# EAGLE design motor (EAGLE 6.5.0)
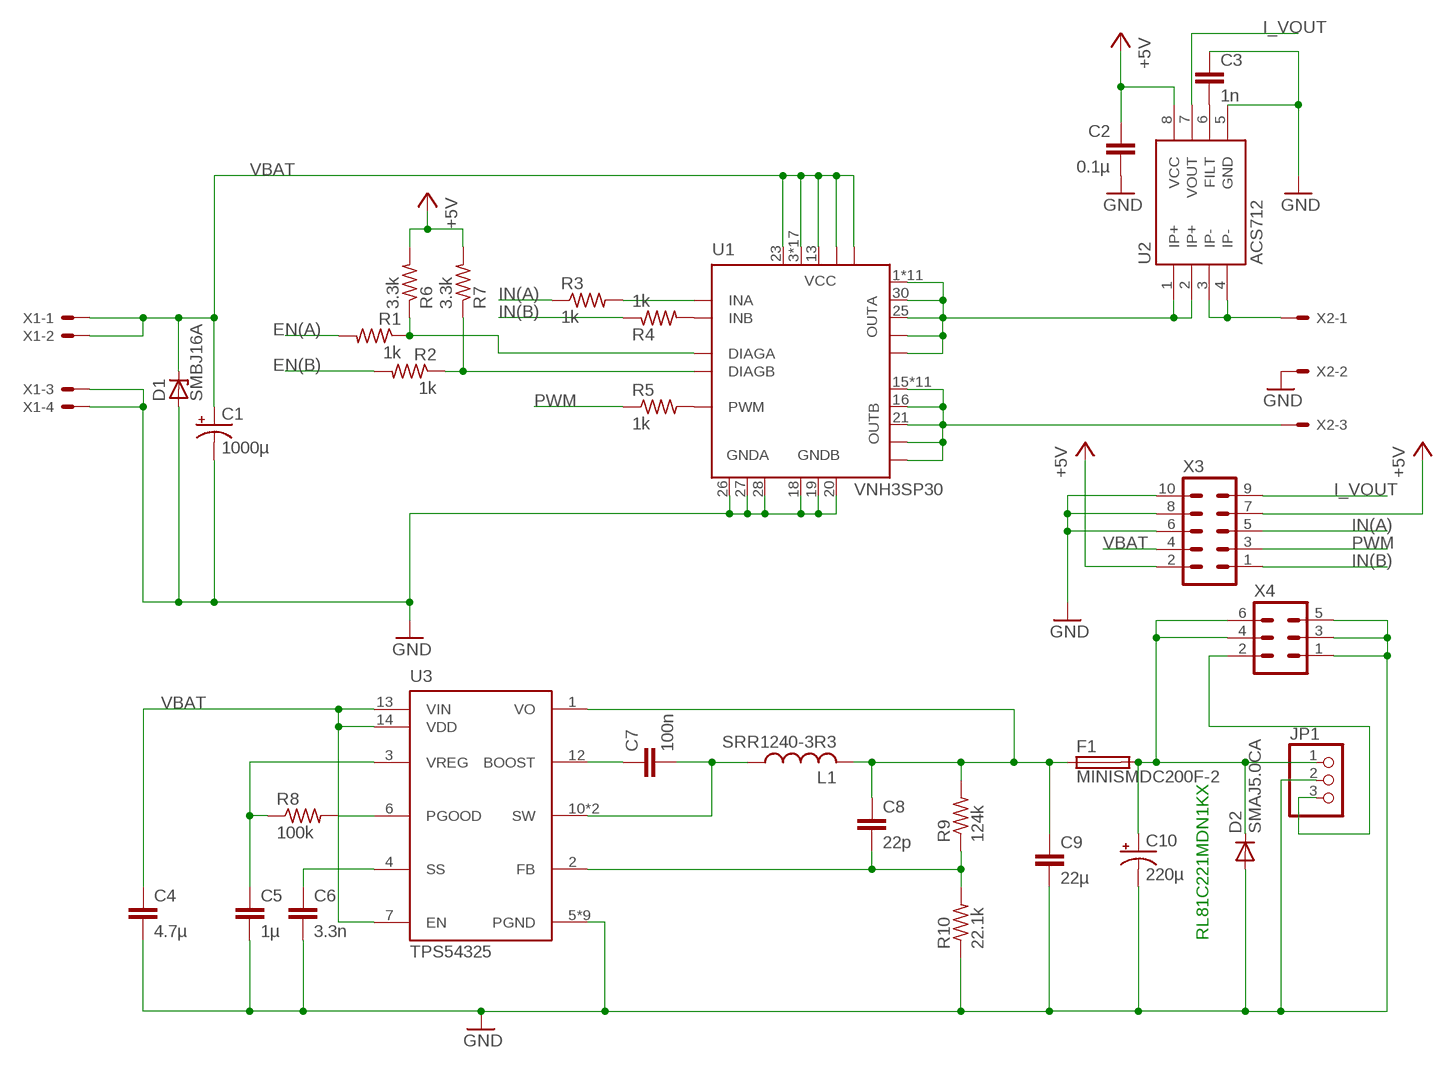
[diagram p0: schematic, sheet 1]

## Parts
C1  1000µ  CPOL-USE5-13  [E5-13]
C2  0.1µ  C-EUC0805  [C0805]
C3  1n  C-EUC0805  [C0805]
C4  4.7µ  C-EUC1206  [C1206]
C5  1µ  C-EUC0805  [C0805]
C6  3.3n  C-EUC0805  [C0805]
C7  100n  C-EUC0805  [C0805]
C8  22p  C-EUC0805  [C0805]
C9  22µ  C-EUC3225  [C3225]
C10  220µ  CPOL-USE3.5-8  [E3,5-8]
D1  SMBJ16A  ZENER-DIODESMB  [SMB]
D2  SMAJ5.0CA  DIODE-DO-214AC  [DO-214AC]
F1  MINISMDC200F-2  FUSEMINISMDC200F  [MINISMDC200F]
JP1  PINHD-1X3  [1X03]
L1  SRR1240-3R3  L-USHCM1103  [HCM1103]
R1  1k  R-US_R0805  [R0805]
R2  1k  R-US_R0805  [R0805]
R3  1k  R-US_R0805  [R0805]
R4  1k  R-US_R0805  [R0805]
R5  1k  R-US_R0805  [R0805]
R6  3.3k  R-US_R0805  [R0805]
R7  3.3k  R-US_R0805  [R0805]
R8  100k  R-US_R0805  [R0805]
R9  124k  R-US_R0805  [R0805]
R10  22.1k  R-US_R0805  [R0805]
U1  VNH3SP30  [MULTIPOWERSO-30]
U2  ACS712  [SO08]
U3  TPS54325  [HTSSOP14PWP]
X1  KK-156-4  [KK-156-4]
X2  KK-156-3  [KK-156-3]
X3  ML10  [ML10]
X4  ML6  [ML6]

## Nets
+5V: C2.1 R6.2 R7.2 U2.8(VCC) X3.2 X3.7
+5V/S: C8.1 C9.1 F1.1 L1.P$2 R9.2 U3.1(VO)
EN(A): R1.2
EN(B): R2.2
GND: C1.- C2.2 C3.1 C4.2 C5.2 C6.2 C9.2 C10.- D1.A D2.A JP1.2 R10.1 U1.18(GNDB) U1.19(GNDB) U1.20(GNDB) U1.26(GNDA) U1.27(GNDA) U1.28(GNDA) U2.5(GND) U3.5(PGND) U3.8(PGND) U3.9(PGND) U3.EXP1(PGND) U3.EXP(PGND) U3.P$1(PGND) U3.P$2(PGND) U3.P$3(PGND) U3.P$4(PGND) X1.3 X1.4 X2.2 X3.6 X3.8 X3.10 X4.1 X4.3 X4.5
I_VOUT: U2.7(VOUT) X3.9
IN(A): R3.1 X3.5
IN(B): R4.1 X3.1
N$1 [power]: U1.15(OUTB) U1.16(OUTB) U1.21(OUTB) U1.OUTB U1.OUTB1(OUTB) U1.OUTB2(OUTB) U1.OUTB3(OUTB) U1.OUTB4(OUTB) U1.OUTB5(OUTB) U1.OUTB6(OUTB) U1.OUTB7(OUTB) U1.OUTB8(OUTB) U1.OUTB9(OUTB) U1.OUTB10(OUTB) U1.OUTB@1(OUTB) X2.3
N$2 [power]: U1.1(OUTA) U1.25(OUTA) U1.30(OUTA) U1.OUTA U1.OUTA1(OUTA) U1.OUTA2(OUTA) U1.OUTA3(OUTA) U1.OUTA4(OUTA) U1.OUTA5(OUTA) U1.OUTA6(OUTA) U1.OUTA7(OUTA) U1.OUTA8(OUTA) U1.OUTA9(OUTA) U1.OUTA10(OUTA) U1.OUTA@1(OUTA) U2.1(IP+) U2.2(IP+)
N$3: R3.2 U1.5(INA)
N$4: R4.2 U1.11(INB)
N$6: R8.2 U3.6(PGOOD)
N$7: R1.1 R6.1 U1.6(DIAGA)
N$8: R2.1 R7.1 U1.10(DIAGB)
N$9: U2.3(IP-) U2.4(IP-) X2.1
N$10: C5.1 R8.1 U3.3(VREG)
N$11: C3.2 U2.6(FILT)
N$12: C6.1 U3.4(SS)
N$14: C7.1 U3.12(BOOST)
N$15: C7.2 L1.P$1 U3.10(SW) U3.11(SW)
N$16: C8.2 R9.1 R10.2 U3.2(FB)
N$17: C10.+ D2.C F1.2 JP1.1 X4.4 X4.6
N$18: R5.2 U1.8(PWM)
PWM: R5.1 X3.3
S_CTL: JP1.3 X4.2
VBAT: C1.+ C4.1 D1.C U1.3(VCC) U1.13(VCC) U1.23(VCC) U1.VCC U1.VCC1(VCC) U1.VCC2(VCC) U1.VCC3(VCC) U1.VCC4(VCC) U1.VCC5(VCC) U1.VCC6(VCC) U1.VCC7(VCC) U1.VCC8(VCC) U1.VCC9(VCC) U1.VCC10(VCC) U1.VCC11(VCC) U1.VCC12(VCC) U1.VCC13(VCC) U1.VCC14(VCC) U1.VCC15(VCC) U1.VCC16(VCC) U1.VCC@1(VCC) U3.7(EN) U3.13(VIN) U3.14(VDD) X1.1 X1.2 X3.4

## Notes on the sheet
- RL81C221MDN1KX

## Library data of the parts
C1 C10 = rcl:CPOL-US: POLARIZED CAPACITOR, American symbol
C2-C9 = rcl:C-EU: CAPACITOR, European symbol
D1 = diode:ZENER-DIODE: Z-Diode
D2 = diode:DIODE-: DIODE
F1 = miniSMDC200F:FUSE
JP1 = pinhead:PINHD-1X3: PIN HEADER
L1 = inductors:L-US: INDUCTOR, American symbol
R1-R10 = rcl:R-US_: RESISTOR, American symbol
U1 = VNH3SP30:VNH3SP30: FULLY INTEGRATED H-BRIDGE MOTOR DRIVER Source: http://pdf1.alldatasheet.com/datasheet-pdf/view/84563/STMICROELECTRONICS/VNH3SP30.html; MPN: VNH3SP30-E; OC_FARNELL: 1739420; OC_NEWARK: 33R1486
U2 = SparkFun-AnalogIC:ACS712: Hall-effect-based isolated linear current sensor
U3 = TPS54325:TPS54325
X1 = con-molex:KK-156-4: KK 156 HEADER Source: http://www.molex.com/pdm_docs/sd/026604100_sd.pdf; OC_FARNELL: unknown; OC_NEWARK: unknown
X2 = con-molex:KK-156-3: KK 156 HEADER Source: http://www.molex.com/pdm_docs/sd/026604100_sd.pdf; OC_FARNELL: unknown; OC_NEWARK: unknown
X3 = con-ml:ML10: HARTING; OC_FARNELL: unknown; OC_NEWARK: unknown
X4 = con-harting-ml:ML6: HARTING; OC_FARNELL: unknown; OC_NEWARK: unknown

## Net classes
1 power: clearance 0.813 mm

## Board
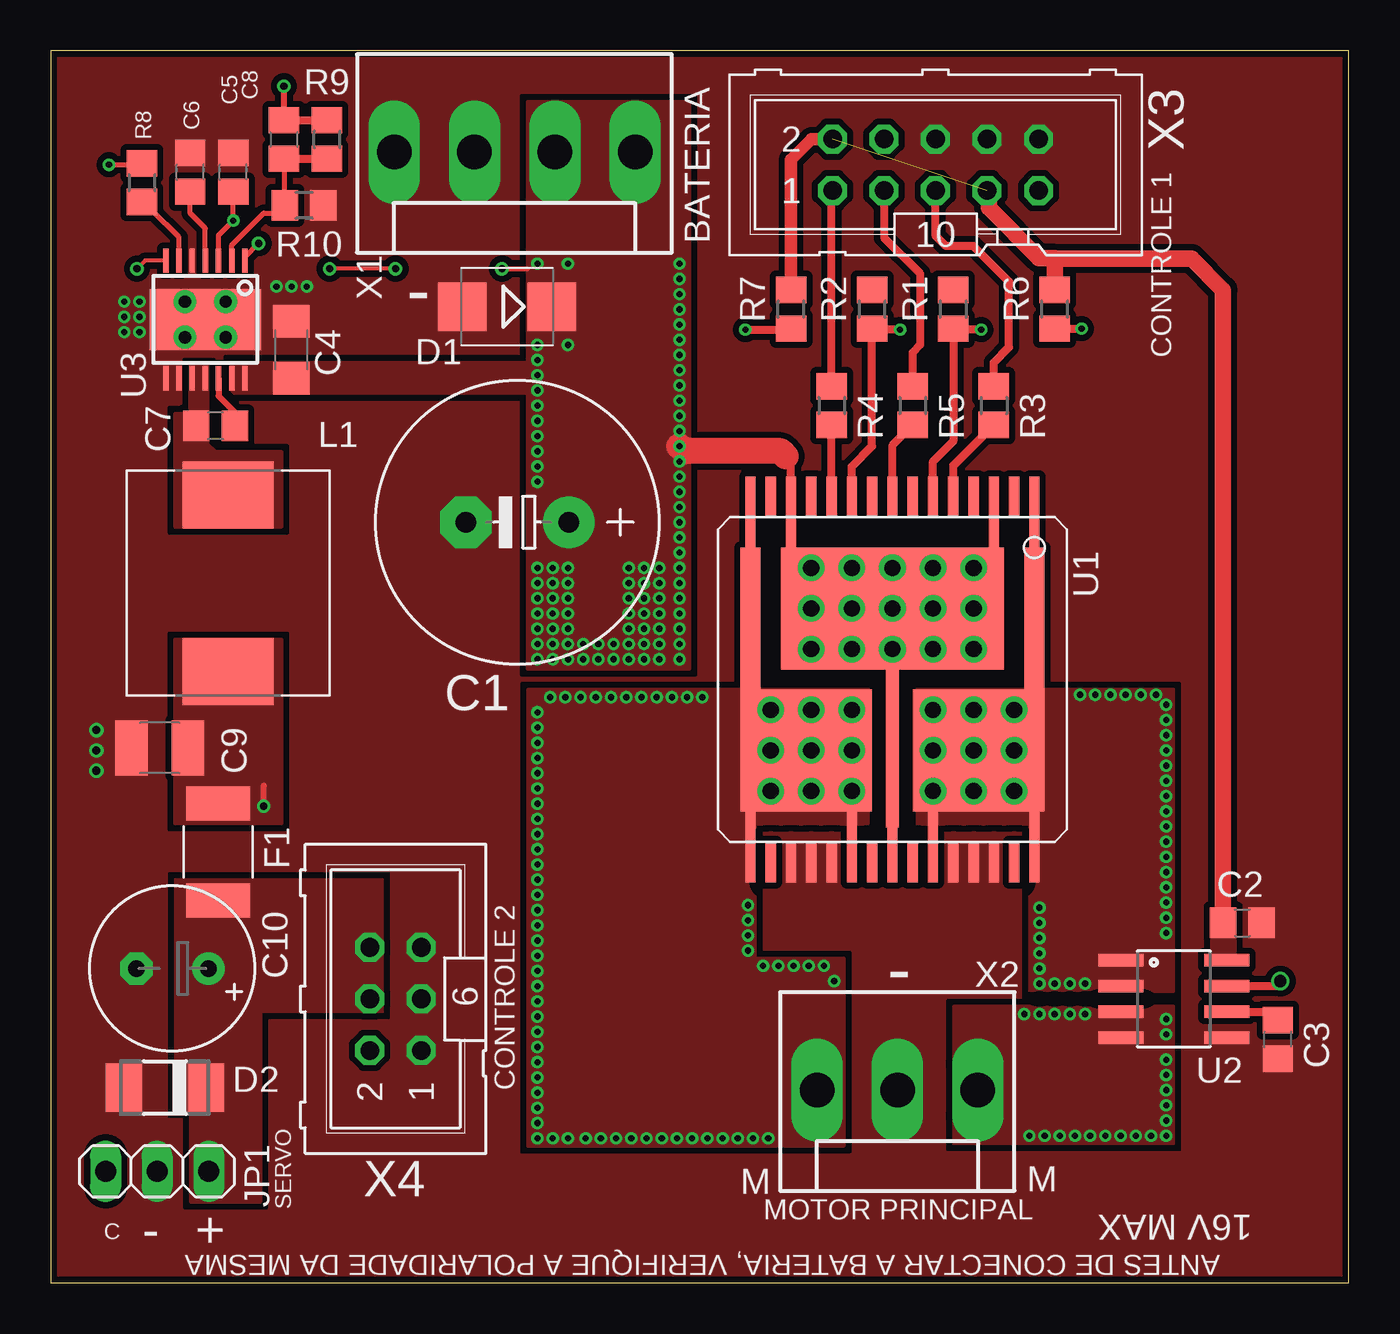
[diagram p1: board, top side]
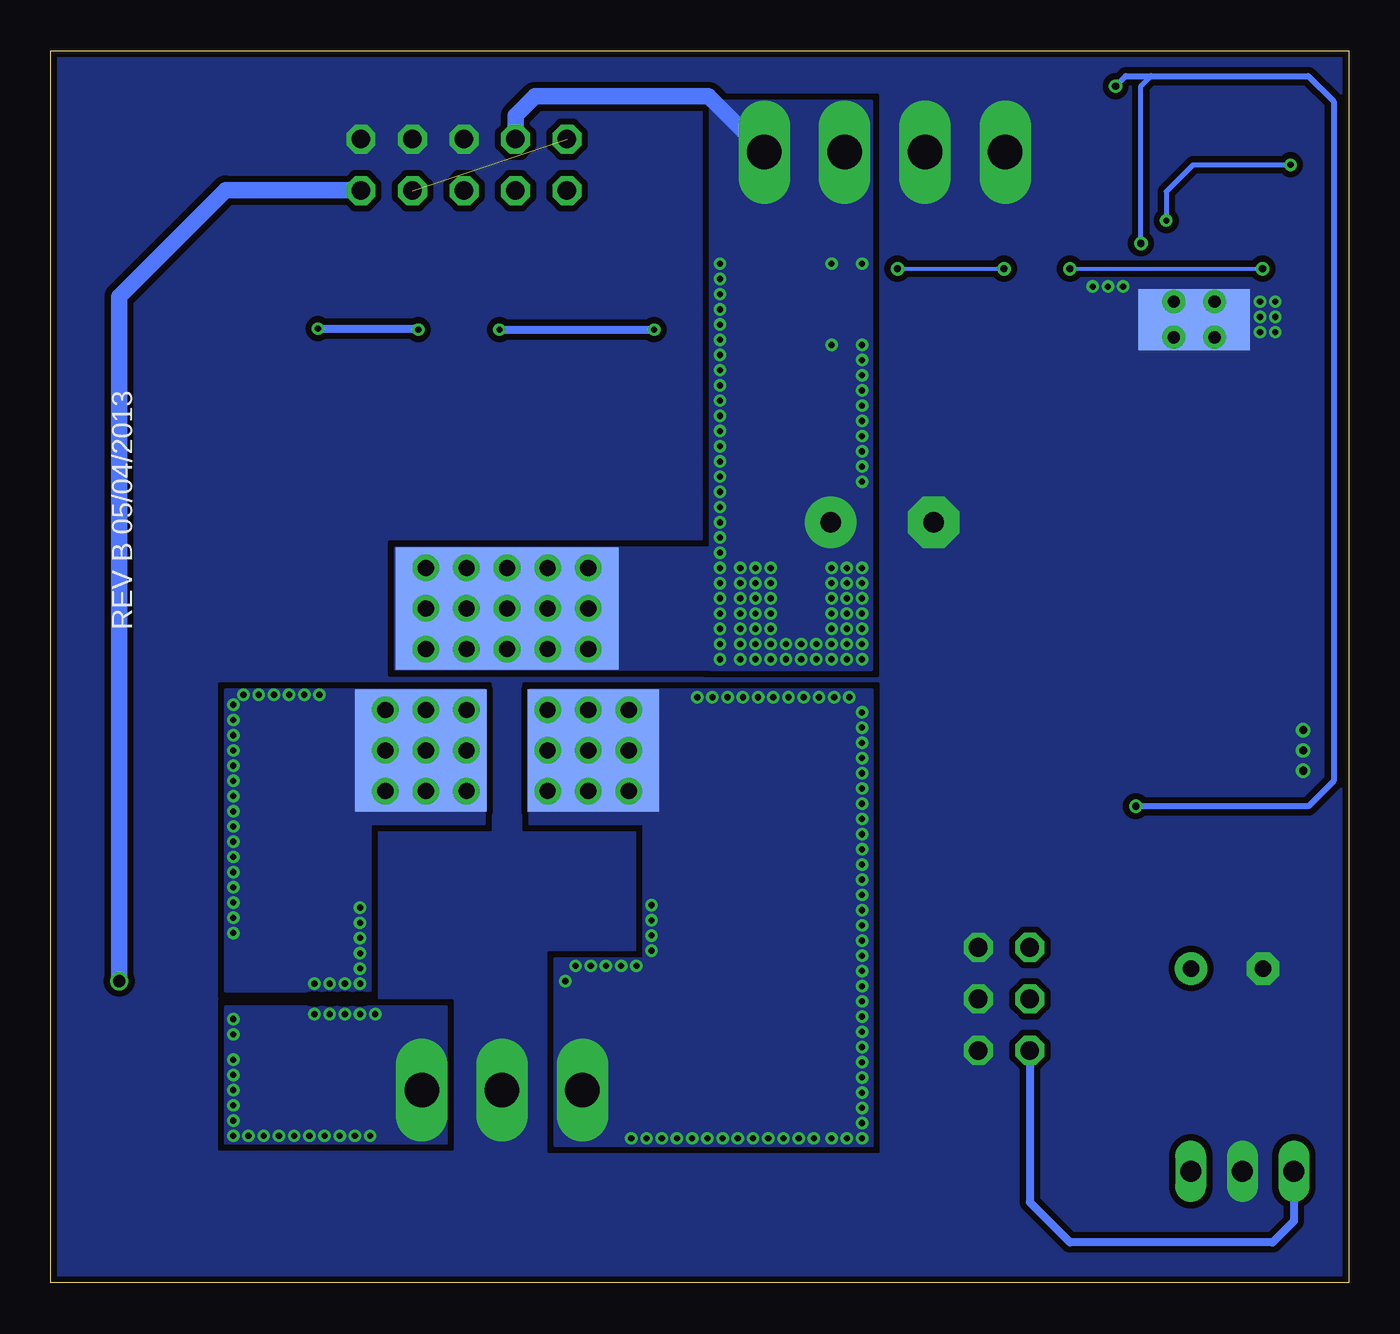
[diagram p2: board, bottom side, seen from below]

Size 64 x 60.75 mm. Coordinates in mm from the lower left corner, seen from the top.
Outline: 64,0 64,60.75 0,60.75 0,0 64,0
Copper layers (1*16): Top 0.035mm / dielectric 1.5mm / Bottom 0.035mm
Design rules "Fusion_eagle_rule_v1.1": minimum track width 6mil, minimum drill 12mil, track to track 6mil, track to pad 6mil, pad to pad 6mil, via to via 6mil, smd to smd 0mil, copper to edge 10mil, drill to drill 10mil, minimum pad ring 10mil, minimum via ring 6mil, stop-mask expansion 2mil, vias tented up to drill 100mil, thermal gap 10mil

### Footprints (pad centres in the part's own frame; a part is rotated, then mirrored left to right if it is on the bottom)
E5-13 = drill 1.016 pad 2.54: + -2.54,0 | drill 1.016 pad 2.54 octagon: - 2.54,0
C0805 = smd 1.3 x 1.5: 1 -0.95,0; 2 0.95,0
C1206 = smd 1.6 x 1.8: 1 -1.4,0; 2 1.4,0
C3225 = smd 1.6 x 2.7: 1 -1.4,0; 2 1.4,0
E3,5-8 = drill 0.813 pad 1.6: + -1.778,0 | drill 0.813 pad 1.6 octagon: - 1.778,0
SMB = smd 2.4 x 2.4: A 2.2,0; C -2.2,0
DO-214AC = smd 1.8 x 2.4: A 2.025,0; C -2.025,0
MINISMDC200F = smd 1.68 x 3.15: 1 -2.39,0; 2 2.39,0
1X03 = drill 1.016 long: 1 -2.54,0; 2 0,0; 3 2.54,0
HCM1103 = smd 3.3 x 4.5: P$1 -4.35,0; P$2 4.35,0
R0805 = smd 1.3 x 1.5: 1 -0.95,0; 2 0.95,0
MULTIPOWERSO-30 = smd 0.508 x 12: 1 -7,-4; 15 7,-4; 16 7,4; 30 -7,4 | smd 0.508 x 2: 2 -6,-9; 4 -4,-9; 5 -3,-9; 6 -2,-9; 7 -1,-9; 8 0,-9; 9 1,-9; 10 2,-9; 11 3,-9; 12 4,-9; 14 6,-9; 17 6,9; 18 5,9; 19 4,9; 20 3,9; 22 1,9; 24 -1,9; 26 -3,9; 27 -4,9; 28 -5,9; 29 -6,9 | smd 0.508 x 4: 3 -5,-8; 13 5,-8; 21 2,8; 23 0,8; 25 -2,8 | smd 6.5 x 6 bottom: OUTA -4.25,3.5; OUTB 4.25,3.5 | smd 6.5 x 6: OUTA1 -4.25,3.5; OUTB1 4.25,3.5 | drill 0.8: OUTA2 -6,5.5; OUTA3 -4,5.5; OUTA4 -2,5.5; OUTA5 -6,3.5; OUTA6 -4,3.5; OUTA7 -2,3.5; OUTA8 -2,1.5; OUTA9 -4,1.5; OUTA10 -6,1.5; OUTB2 2,5.5; OUTB3 4,5.5; OUTB4 6,5.5; OUTB5 6,3.5; OUTB6 4,3.5; OUTB7 2,3.5; OUTB8 2,1.5; OUTB9 4,1.5; OUTB10 6,1.5; VCC2 -4,-1.5; VCC3 -2,-1.5; VCC4 0,-1.5; VCC5 2,-1.5; VCC6 4,-1.5; VCC7 4,-3.5; VCC8 2,-3.5; VCC9 0,-3.5; VCC10 -2,-3.5; VCC11 -4,-3.5; VCC12 -4,-5.5; VCC13 -2,-5.5; VCC14 0,-5.5; VCC15 2,-5.5; VCC16 4,-5.5 | smd 1 x 7.5: OUTA@1 -7,-2.755; OUTB@1 7,-2.755 | smd 11 x 6 bottom: VCC 0,-3.5 | smd 11 x 6: VCC1 0,-3.5 | smd 0.65 x 8.3: VCC@1 0,3.145
SO08 = smd 0.61 x 2.21: 1 -1.905,-2.616; 2 -0.635,-2.616; 3 0.635,-2.616; 4 1.905,-2.616; 5 1.905,2.616; 6 0.635,2.616; 7 -0.635,2.616; 8 -1.905,2.616
HTSSOP14PWP = smd 0.27 x 1.2: 1 -1.95,-2.9; 2 -1.3,-2.9; 3 -0.65,-2.9; 4 0,-2.9; 5 0.65,-2.9; 6 1.3,-2.9; 7 1.95,-2.9; 8 1.95,2.9; 9 1.3,2.9; 10 0.65,2.9; 11 0,2.9; 12 -0.65,2.9; 13 -1.3,2.9; 14 -1.95,2.9 | smd 5.5 x 3 bottom: EXP 0,0 | smd 5.5 x 3: EXP1 0,0 | drill 0.61: P$1 -1,0.875; P$2 -1,-0.875; P$3 1,-0.875; P$4 1,0.875
KK-156-4 = drill 1.7 pad 2.184 long: 1 -5.94,0; 2 -1.98,0; 3 1.98,0; 4 5.94,0
KK-156-3 = drill 1.7 pad 2.184 long: 1 -3.96,0; 2 0,0; 3 3.96,0
ML10 = drill 0.914 octagon: 1 -5.08,-1.27; 2 -5.08,1.27; 3 -2.54,-1.27; 4 -2.54,1.27; 5 0,-1.27; 6 0,1.27; 7 2.54,-1.27; 8 2.54,1.27; 9 5.08,-1.27; 10 5.08,1.27
ML6 = drill 0.914 octagon: 1 -2.54,-1.27; 2 -2.54,1.27; 3 0,-1.27; 4 0,1.27; 5 2.54,-1.27; 6 2.54,1.27

### Placement (x,y rotation side)
C1  23,37.5 180 top
C2  58.75,17.75 0 top
C3  60.5,12 90 top
C4  11.88,46 90 top
C5  9,54.75 90 top
C6  6.88,54.75 90 top
C7  8.12,42.25 180 top
C8  11.5,56.38 270 top
C9  5.38,26.38 180 top
C10  6,15.5 180 top
D1  22.5,48.12 180 top
D2  5.62,9.62 180 top
F1  8.25,21.25 270 top
JP1  5.25,5.5 180 top
L1  8.75,34.5 270 top
R1  44.5,48 90 top
R2  40.5,48 90 top
R3  46.5,43.25 270 top
R4  38.5,43.25 270 top
R5  42.5,43.25 270 top
R6  49.5,48 90 top
R7  36.5,48 90 top
R8  4.5,54.25 270 top
R9  13.62,56.38 90 top
R10  12.5,53.12 180 top
U1  41.5,29.75 180 top
U2  55.38,14 270 top
U3  7.62,47.5 180 top
X1  22.88,55.75 180 top
X2  41.75,9.5 180 top
X3  43.62,55.12 0 top
X4  17,14 90 top

### Tracks (layer width: path | path; a pad name or v marks a point on that pad's centre or on a via)
+5V  (1 unrouted)
  Top 0.61: R7.2 36.5,55.38 37.5,56.38 38.52,56.38 X3.2
  Top 0.813: R6.2 49.5,50.52 | 49.5,50.52 49.52,50.5 56.25,50.5 57.8,48.95 C2.1 | 49.5,50.52 48.73,50.52 46.25,53 46.25,53.77 X3.7
  pour Top (isolate 0.254, no thermals): 57.25,18.38 58.38,18.38 58.38,15.75 57.25,15.75
+5V/S  (via drill 0.36)
  Top 0.254: U3.1 9.57,50.58 v10.25,51.25
  Top 0.305: C8.1 v11.5,59 | v10.5,23.5 10.5,24.5
  Top 0.406: C8.1 R9.2
  Bottom 0.254: v10.25,51.25 10.25,59 9.75,59.5
  Bottom 0.305: v11.5,59 11,59.5 9.75,59.5 2,59.5 0.75,58.25 0.75,24.75 2,23.5 v10.5,23.5
  pour Top (isolate 0.406, no thermals): 6.12,31.75 11.38,31.75 11.38,22.62 6.12,22.62
GND  (via drill 0.3, 0.4)
  other vias: 3.62,48.38 3.62,47.62 3.62,46.88 4.38,47.62 4.38,48.38 4.38,46.88 2.25,27.25 2.25,26.25 2.25,25.25 11.12,49.12 11.88,49.12 12.62,49.12
  pour Top (isolate 0.305, rank 6, no thermals): 0,0 64,0 64,60.75 0,60.75
  pour Bottom (isolate 0.305, rank 6, no thermals): 0,0 64,0 64,60.75 0,60.75
I_VOUT  (via drill 0.6)
  Top 0.406: U2.7 60.38,14.63 v60.62,14.88
  Bottom 0.813: v60.62,14.88 60.62,48.62 55.38,53.88 48.73,53.88 X3.9
IN(A)
  Top 0.406: R3.1 46.5,45.38 47.25,46.12 47.25,49.38 45.5,51.12 44.12,51.12 43.62,51.62 X3.5
IN(B)
  Top 0.406: R4.1 38.5,53.81 X3.1
N$1  (via drill 0.3)
  other vias: 34.38,18.62 34.38,17.88 34.38,17.12 34.38,16.38 35.12,15.62 35.88,15.62 36.62,15.62 37.38,15.62 38.12,15.62 32.12,28.88 31.38,28.88 30.62,28.88 29.88,28.88 29.12,28.88 28.38,28.88 27.62,28.88 26.88,28.88 26.12,28.88 24,28.12 24,27.38 24,26.62 24,25.88 24,25.12 24,24.38 24,23.62 24,22.88 24,22.12 24,21.38 24,20.62 24,19.88 24,19.12 24,18.38 24,17.62 24,16.88 24,16.12 24,15.38 24,14.62 24,13.88 24,13.12 24,12.38 24,11.62 24,10.88 24,8.62 24,7.88 26.38,7.12 27.12,7.12 27.88,7.12 28.62,7.12 29.38,7.12 30.12,7.12 30.88,7.12 31.62,7.12 32.38,7.12 33.12,7.12 33.88,7.12 34.62,7.12 35.38,7.12 24,9.38 24,10.12 38.62,14.88 25.38,28.88 25.5,7.12 24.62,28.88 24.75,7.12 24,7.12
  pour Bottom (isolate 0.813, no thermals): 40.38,29.25 23.5,29.25 23.5,6.75 39.12,6.75 39.12,16 34.75,16 34.75,22.62 40.38,22.62
  pour Top (isolate 0.813, no thermals): 40.38,29.25 23.5,29.25 23.5,6.75 39.12,6.75 39.12,16 34.75,16 34.75,22.62 40.38,22.62
N$2  (via drill 0.3)
  other vias: 50.75,29 51.5,29 52.25,29 53,29 53.75,29 54.5,29 55,28.5 55,27.75 55,27 55,26.25 55,25.5 55,24.75 55,24 55,23.25 55,22.5 55,21.75 55,21 55,20.25 55,19.5 55,18.75 55,18 55,17.25 48.75,18.5 48.75,17.75 48.75,17 48.75,16.25 48.75,15.5 48.75,14.75 49.5,14.75 50.25,14.75 51,14.75
  pour Bottom (isolate 0.813, no thermals): 42.62,29.25 42.62,22.62 48.25,22.62 48.25,14.38 55.38,14.38 55.38,29.25
  pour Top (isolate 0.813, no thermals): 42.62,29.25 42.62,22.62 48.25,22.62 48.25,14.38 55.38,14.38 55.38,29.25
N$3
  Top 0.406: U1.5 44.5,40.3 R3.2
N$4
  Top 0.406: U1.11 R4.2
N$6
  Top 0.254: U3.6 6.33,51.55 5,52.88 4.92,52.88 R8.2
N$7  (via drill 0.3)
  Top 0.406: R6.1 v50.83,47.05 | v45.88,47 44.55,47 R1.1 44.5,41.5 43.5,40.5 U1.6
  Bottom 0.406: v50.83,47.05 46.05,47.05 v45.88,47
N$8  (via drill 0.3)
  Top 0.406: v34.25,47 36.45,47 R7.1 | v41.88,47 40.55,47 R2.1 40.5,41.25 39.5,40.25 U1.10
  Bottom 0.406: v41.88,47 v34.25,47
N$9  (via drill 0.3)
  other vias: 48,13.25 48.75,13.25 49.5,13.25 50.25,13.25 51,13.25 55,11 55,12.25 55,13 55,10.25 55,9.5 55,8.75 55,7.25 54.25,7.25 53.5,7.25 52.75,7.25 52,7.25 51.25,7.25 50.5,7.25 49.75,7.25 49,7.25 48.25,7.25 55,8
  pour Top (isolate 0.813, no thermals): 44.5,6.88 55.38,6.88 55.38,13.62 44.5,13.62
  pour Bottom (isolate 0.813, no thermals): 44.5,6.88 55.38,6.88 55.38,13.62 44.5,13.62
N$10  (via drill 0.3)
  Top 0.254: U3.3 8.28,51.65 v9,52.38 C5.1 | v2.88,55.12 4.42,55.12 R8.1
  Bottom 0.254: v2.88,55.12 7.67,55.12 C5.1 v9,52.38
N$11
  Top 0.406: U2.6 60.09,13.37 C3.2
N$12
  Top 0.254: U3.4 7.62,52 6.88,52.75 C6.1
N$14
  Top 0.305: U3.12 8.28,43.73 9.25,42.75 9.25,42.42 C7.1
N$15
  pour Top (no thermals): 6.88,45.25 7.75,45.25 7.75,41.62 6.88,41.62
  pour Top (isolate 0.254, no thermals): 7.75,42.88 7.75,41.38 8.12,41 11.38,41 11.38,37.25 6.12,37.25 6.12,42.88
N$16
  Top 0.254: U3.2 8.93,51.17 10.5,52.75 11.18,52.75 R10.2 11.5,53.17 C8.2
  Top 0.406: C8.2 R9.1
N$17
  pour Top (isolate 0.254, no thermals): 6.12,19.88 6.12,8.5 6.88,8.5 6.88,4 10.38,4 10.38,19.88
  pour Top (isolate 0.254, no thermals): 9.38,13.38 16.38,13.38 16.38,19.88 9.38,19.88
N$18
  Top 0.406: U1.8 41.5,41.3 R5.2
PWM
  Top 0.406: R5.1 42.5,45.88 42.88,46.25 42.88,49.75 41.09,51.54 X3.3
S_CTL
  Bottom 0.406: JP1.3 2.71,3.04 3.75,2 13.75,2 15.73,3.98 X4.2
VBAT  (via drill 0.3, 0.36)
  Top 0.152: U1.VCC@1 U1.VCC4 41.5,32 | U1.3 46.5,36 46.25,36 U1.VCC12
  Top 0.203: U3.7 4.65,50.4 v4.25,50 | v17,50 v13.75,50
  Top 0.254: v22.25,50 23.5,50
  Top 0.406: U1.23 U1.VCC@1 | U1.13 36.5,40.5 36.25,40.75
  Top 1.27: v31,41.25 31.25,41 36,41 36.25,40.75
  Bottom 0.203: v22.25,50 v17,50 | v13.75,50 v4.25,50
  Bottom 0.813: X3.4 41.09,57.54 40.12,58.5 31.57,58.5 X1.1
  other vias: 31,50.25 31,49.5 31,48.75 31,48 31,47.25 31,46.5 31,45.75 31,45 31,44.25 31,43.5 31,42.75 31,42 31,40.5 31,36.75 24,35.25 24,34.5 24,33.75 24,33 24,32.25 24,31.5 24,30.75 24.75,30.75 25.5,30.75 26.25,30.75 27,30.75 27.75,30.75 28.5,30.75 24,50.25 24,46.25 24,45.5 24,44.75 24,44 24,43.25 24,41.75 24,41 24,40.25 25.5,50.25 25.5,46.25 31,39.75 31,39 31,38.25 31,37.5 24,42.5 24,39.5 29.25,30.75 30,30.75 31,30.75 31,36 31,35.25 31,34.5 31,33.75 31,33 31,32.25 31,31.5 30,32.25 30,33 30,33.75 29.25,32.25 28.5,32.25 25.5,32.25 24.75,32.25 24.75,31.5 25.5,31.5 26.25,31.5 27,31.5 27.75,31.5 28.5,31.5 29.25,31.5 30,31.5 29.25,33 28.5,33 25.5,33 24.75,33 24.75,33.75 25.5,33.75 28.5,33.75 29.25,33.75 24.75,34.5 25.5,34.5 28.5,34.5 29.25,34.5 30,34.5 30,35.25 29.25,35.25 24.75,35.25 25.5,35.25 28.5,35.25
  pour Top (isolate 0.61, no thermals): 31.5,58.25 31.5,30.25 23.5,30.25 23.5,58.25
  pour Bottom (isolate 0.813, no thermals): 31.5,58.25 31.5,30.25 23.5,30.25 23.5,58.25
  pour Top (isolate 0.406, no thermals): 8.88,43.88 23.5,43.88 23.5,45.38 8.88,45.38
  pour Bottom (isolate 0.813, no thermals): 31.5,30.25 47,30.25 47,36.25 31.5,36.25

### Text on the board
tPlace: BATERIA | - | CONTROLE 1 | - | CONTROLE 2 | SERVO | M | M | MOTOR PRINCIPAL | 16V MAX | C | - | + | ANTES DE CONECTAR A BATERIA, VERIFIQUE A POLARIDADE DA MESMA
bPlace: REV B 05/04/2013